# Altium schematic sheet 最小系统.SchDoc
size A4; Time: 2022/05/15
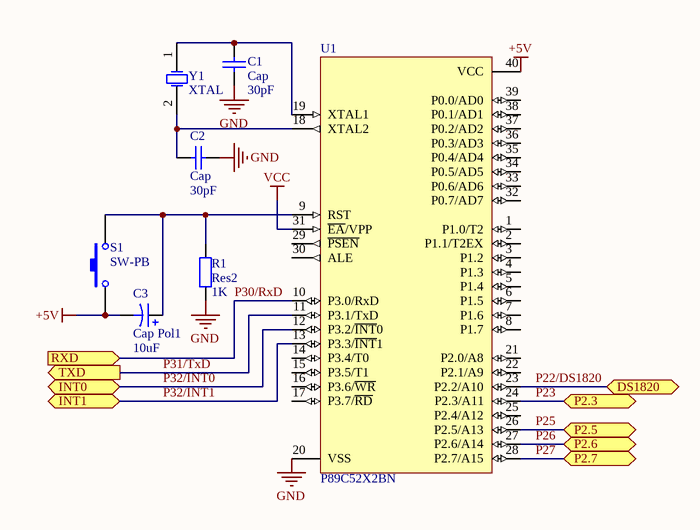
[diagram p0: 最小系统.SchDoc]

## Parts
C1  Cap  value 30pF  [RAD-0.3]
C2  Cap  value 30pF  [RAD-0.3]
C3  Cap Pol1  value 10uF  [RB7.6-15]
R1  Res2  value 1K  [AXIAL-0.4]
S1  SW-PB  [SPST-2]
U1  P89C52X2BN  [SOT129-1]
Y1  XTAL  [R38]

## Ports
DS1820 (bidir), INT0 (bidir), INT1 (bidir), P2.3 (bidir), P2.5 (bidir), P2.6 (bidir), P2.7 (bidir), RXD (in), TXD (out)

## Nets
+5V: C3.2 S1.1 U1.40(VCC)
GND: C1.1 C2.1 R1.1 U1.20(VSS)
VCC: U1.31(~{EA}/VPP)
P22/DS1820: U1.23(P2.2/A10) ; port DS1820
P23: U1.24(P2.3/A11) ; port P2.3
P25: U1.26(P2.5/A13) ; port P2.5
P26: U1.27(P2.6/A14) ; port P2.6
P27: U1.28(P2.7/A15) ; port P2.7
P30/RxD: U1.10(P3.0/RxD) ; port RXD
P31/TxD: U1.11(P3.1/TxD) ; port TXD
P32/INT0: U1.12(P3.2/~{INT}0) ; port INT0
P32/INT1: U1.13(P3.3/~{INT}1) ; port INT1
NetC1_2: C1.2 U1.19(XTAL1) Y1.1(OSC1)
NetC2_2: C2.2 U1.18(XTAL2) Y1.2(OSC2)
NetC3_1: C3.1 R1.2 S1.2 U1.9(RST)

Not connected (* = marked no-connect by the designer): U1 1(P1.0/T2) 2(P1.1/T2EX) 3(P1.2) 4(P1.3) 5(P1.4) 6(P1.5) 7(P1.6) 8(P1.7) 14(P3.4/T0) 15(P3.5/T1) 16(P3.6/~{WR}) 17(P3.7/~{RD}) 21(P2.0/A8) 22(P2.1/A9) 25(P2.4/A12) 29(~{PSEN}) 30(ALE) 32(P0.7/AD7) 33(P0.6/AD6) 34(P0.5/AD5) 35(P0.4/AD4) 36(P0.3/AD3) 37(P0.2/AD2) 38(P0.1/AD1) 39(P0.0/AD0)

## Notes on the sheet
- 专升本
- 通信工程
- 李烨攀
- 2101班
- 210806300163
- 学号

## Library data of the parts
C1 C2 = Cap: Capacitor; Published: 8-Jun-2000; LatestRevisionDate: 17-Jul-2002; LatestRevisionNote: Re-released for DXP Platform.; PackageReference: RAD-0.3; Publisher: Altium Limited; PackageDescription: Radial Cap, Thru-Hole; 2 Leads; 0.3 in Pin Spacing
C3 = Cap Pol1: Polarized Capacitor (Radial); Published: 8-Jun-2000; LatestRevisionDate: 17-Jul-2002; LatestRevisionNote: Re-released for DXP Platform.; PackageReference: RB7.6-15; Publisher: Altium Limited; PackageDescription: Polarized Capacitor (Radial); 2 Leads
R1 = Res2: Resistor; Published: 8-Jun-2000; LatestRevisionDate: 17-Jul-2002; LatestRevisionNote: Re-released for DXP Platform.; PackageReference: AXIAL-0.4; Publisher: Altium Limited; PackageDescription: Axial Device, Thru-Hole; 2 Leads; 0.4 in Pin Spacing
S1 = SW-PB: Switch; Published: 24-Mar-1999; LatestRevisionDate: 17-Jul-2002; LatestRevisionNote: Re-released for DXP Platform.; PackageReference: SPST-2; Publisher: Altium Limited; PackageDescription: Switch; 2 Leads
U1 = P89C52X2BN: 80C51 8-Bit Flash Microcontroller Family, 8 kB Flash; Published: 21-May-2003; DatasheetVersion: 5-Jun-2002; PackageVersion: Aug-2000; PackageReference: SOT129-1; Publisher: Altium Limited; PackageDescription: DIP, Plastic; 40 Leads; Row Spacing 15.24 mm; Pitch 2.54 mm; Code_JEDEC: MO-015; ComponentLink1Description: Manufacturer Link; ComponentLink1URL: http://www-us2.semiconductors.philips.com/; ComponentLink2Description: Datasheet; ComponentLink2URL: http://www.semiconductors.philips.com/acrobat/datasheets/P89C5XX2_2.pdf
Y1 = XTAL: Crystal Oscillator; Published: 8-Jun-2000; LatestRevisionDate: 17-Jul-2002; LatestRevisionNote: Re-released for DXP Platform.; PackageReference: R38; Publisher: Altium Limited; PackageDescription: Crystal, Thru-Hole; 2 Leads; Body 3.1 x 8.2 mm (Dia.xH)